# EAGLE design peilsender (EAGLE 5.11)
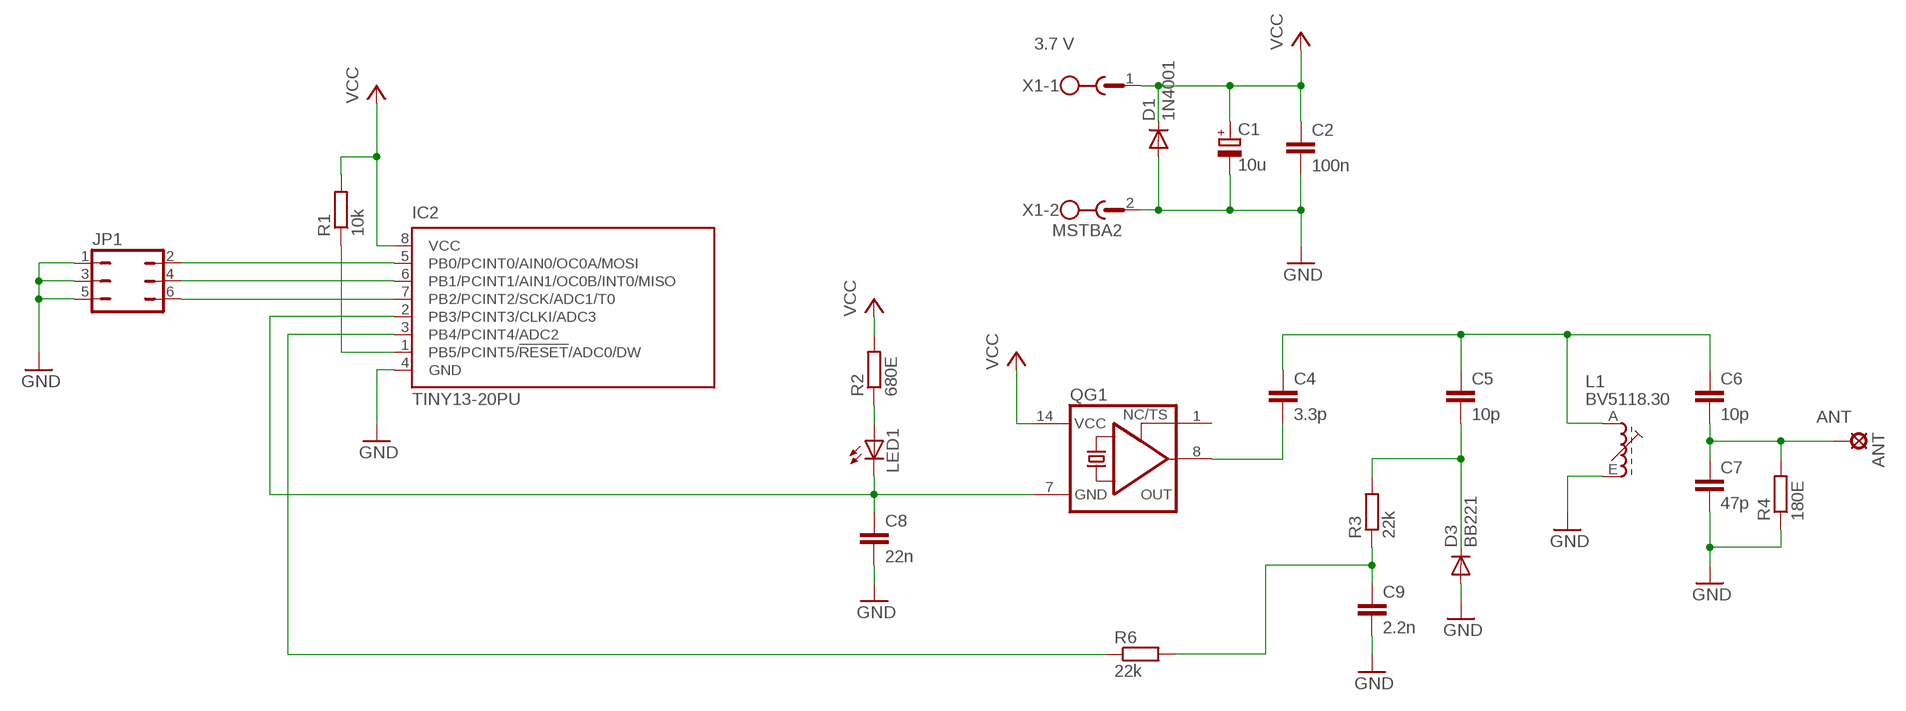
[diagram p0: schematic, sheet 1]

## Parts
ANT  MCS10B  [MCS10B]
C1  10u  CPOL-EUE2.5-5  [E2,5-5]
C2  100n  C-EU025-025X050  [C025-025X050]
C4  3.3p  C-EU025-025X050  [C025-025X050]
C5  10p  C-EU025-025X050  [C025-025X050]
C6  10p  C-EU025-025X050  [C025-025X050]
C7  47p  C-EU025-025X050  [C025-025X050]
C8  22n  C-EU025-025X050  [C025-025X050]
C9  2.2n  C-EU025-025X050  [C025-025X050]
D1  1N4001  DIODE-D-7.5  [D-7.5]
D3  BB221  DIODE-D-7.5  [D-7.5]
IC2  TINY13-20PU  [DIL08]
JP1  JP3Q  [JP3Q]
L1  BV5118.30  71E  [71E]
LED1  LED3MM  [LED3MM]
QG1  XO-14  [DIL14S]
R1  10k  R-EU_0207/12  [0207/12]
R2  680E  R-EU_0207/10  [0207/10]
R3  22k  R-EU_0207/10  [0207/10]
R4  180E  R-EU_0207/10  [0207/10]
R6  22k  R-EU_0207/10  [0207/10]
X1  MSTBA2  [MSTBA2]

## Nets
ANT: ANT.MP C6.2 C7.1 R4.2
GND: C1.- C2.2 C7.2 C8.2 C9.2 D1.A D3.A IC2.4(GND) JP1.1 JP1.3 JP1.5 L1.E R4.1 X1.2
N$1: LED1.A R2.1
N$2: C8.1 IC2.2(PB3/PCINT3/CLKI/ADC3) LED1.K(C) QG1.7(GND)
N$3: C4.2 QG1.8(OUT)
N$4: C4.1 C5.1 C6.1 L1.A
N$5: C5.2 D3.C R3.2
N$6: C9.1 R3.1 R6.2
N$7: IC2.3(PB4/PCINT4/ADC2) R6.1
N$8: IC2.5(PB0/PCINT0/AIN0/OC0A/MOSI) JP1.2
N$9: IC2.6(PB1/PCINT1/AIN1/OC0B/INT0/MISO) JP1.4
N$10: IC2.7(PB2/PCINT2/SCK/ADC1/T0) JP1.6
N$13: IC2.1(PB5/PCINT5/!RESET!/ADC0/DW) R1.1
VCC: C1.+ C2.1 D1.C IC2.8(VCC) QG1.14(VCC) R1.2 R2.2 X1.1
Unconnected: L1.S1 L1.S2 QG1.1(TS)

## Notes on the sheet
- 3.7 V

## Library data of the parts
ANT = solpad:MCS10B: SOLDER PAD MC S1, distributor Buerklin, 15F505
C1 = rcl:CPOL-EU: POLARIZED CAPACITOR, European symbol
C2 C4-C9 = rcl:C-EU: CAPACITOR, European symbol
D1 D3 = diode:DIODE-: DIODE
IC2 = atmel:TINY13: 8-bit AVR Microcontroller with 1K Bytes In-System Programmable Flash Source: http://www.atmel.com/dyn/resources/prod_documents/2535S.pdf; MPN: ATTINY13-20PU; OC_FARNELL: 9171550; OC_NEWARK: 96K6521
JP1 = jumper:JP3Q: JUMPER
L1 = inductor-neosid:71E: FILTER adjustable filter coil, Type E; OC_FARNELL: unknown; OC_NEWARK: unknown
LED1 = led:LED: LED OSRAM: - CHIPLED LG R971, LG N971, LY N971, LG Q971, LY Q971, LO R971, LY R971 LH N974, LH R974 LS Q976, LO Q976, LY Q976 LO Q996 - Hyper CHIPLED LW Q18S LB Q993, LB Q99A, LB R99A - SideLED LS A670, LO A670, LY A670, LG A670, LP A670 LB A673, LV A673, LT A673, LW A673 LH A674 LY A675 LS A676, LA A676, LO A676, LY A676, LW A676 LS A679, LY A679, LG A679 - Hyper Micro SIDELED® LS Y876, LA Y876, LO Y876, LY Y876 LT Y87S - SmartLED LW L88C, LW L88S LB L89C, LB L89S, LG L890 LS L89K, LO L89K, LY L89K LS L896, LA L896, LO L896, LY L896 - TOPLED LS T670, LO T670, LY T670, LG T670, LP T670 LSG T670, LSP T670, LSY T670, LOP T670, LYG T670 LG T671, LOG T671, LSG T671 LB T673, LV T673, LT T673, LW T673 LH T674 LS T676, LA T676, LO T676, LY T676, LB T676, LH T676, LSB T676, LW T676 LB T67C, LV T67C, LT T67C, LS T67K, LO T67K, LY T67K, LW E67C LS E67B, LA E67B, LO E67B, LY E67B, LB E67C, LV E67C, LT E67C LW T67C LS T679, LY T679, LG T679 LS T770, LO T770, LY T770, LG T770, LP T770 LB T773, LV T773, LT T773, LW T773 LH T774 LS E675, LA E675, LY E675, LS T675 LS T776, LA T776, LO T776, LY T776, LB T776 LHGB T686 LT T68C, LB T68C - Hyper Mini TOPLED® LB M676 - Mini TOPLED Santana® LG M470 LS M47K, LO M47K, LY M47K Source: http://www.osram.convergy.de LUXEON: - LUMILED® LXK2-PW12-R00, LXK2-PW12-S00, LXK2-PW14-U00, LXK2-PW14-V00 LXK2-PM12-R00, LXK2-PM12-S00, LXK2-PM14-U00 LXK2-PE12-Q00, LXK2-PE12-R00, LXK2-PE12-S00, LXK2-PE14-T00, LXK2-PE14-U00 LXK2-PB12-K00, LXK2-PB12-L00, LXK2-PB12-M00, LXK2-PB14-N00, LXK2-PB14-P00, LXK2-PB14-Q00 LXK2-PR12-L00, LXK2-PR12-M00, LXK2-PR14-Q00, LXK2-PR14-R00 LXK2-PD12-Q00, LXK2-PD12-R00, LXK2-PD12-S00 LXK2-PH12-R00, LXK2-PH12-S00 LXK2-PL12-P00, LXK2-PL12-Q00, LXK2-PL12-R00 Source: www.luxeon.com KINGBRIGHT: KA-3528ASYC Source: www.kingbright.com
QG1 = crystal:XO-: CRYSTAL; OC_FARNELL: unknown; OC_NEWARK: unknown
R1-R4 R6 = rcl:R-EU_: RESISTOR, European symbol
X1 = con-phoenix-508:MSTBA2: PHOENIX; MF: FARNELL; MPN: 1757242; OC_FARNELL: 3705171; OC_NEWARK: 71C4161

## Board
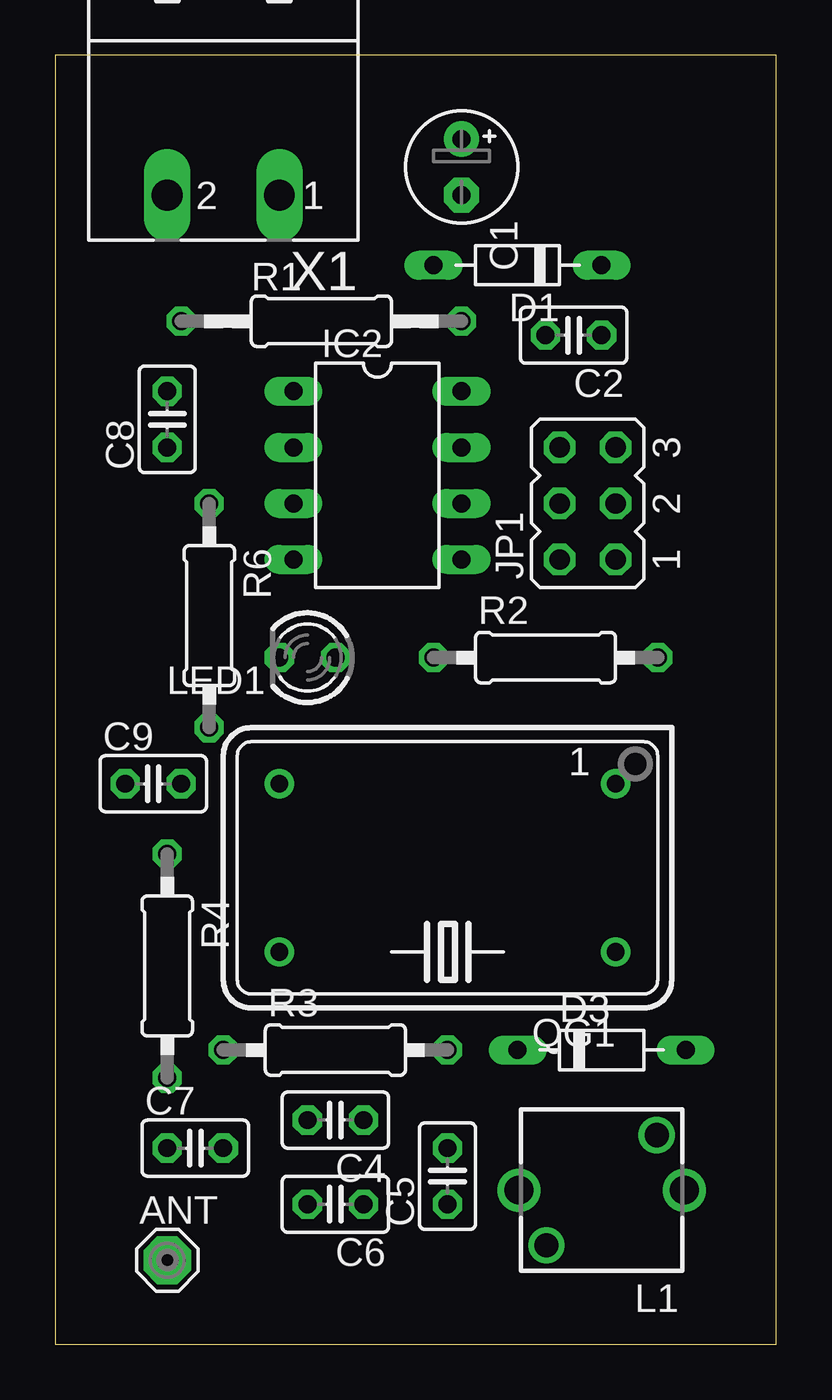
[diagram p1: board, top side]
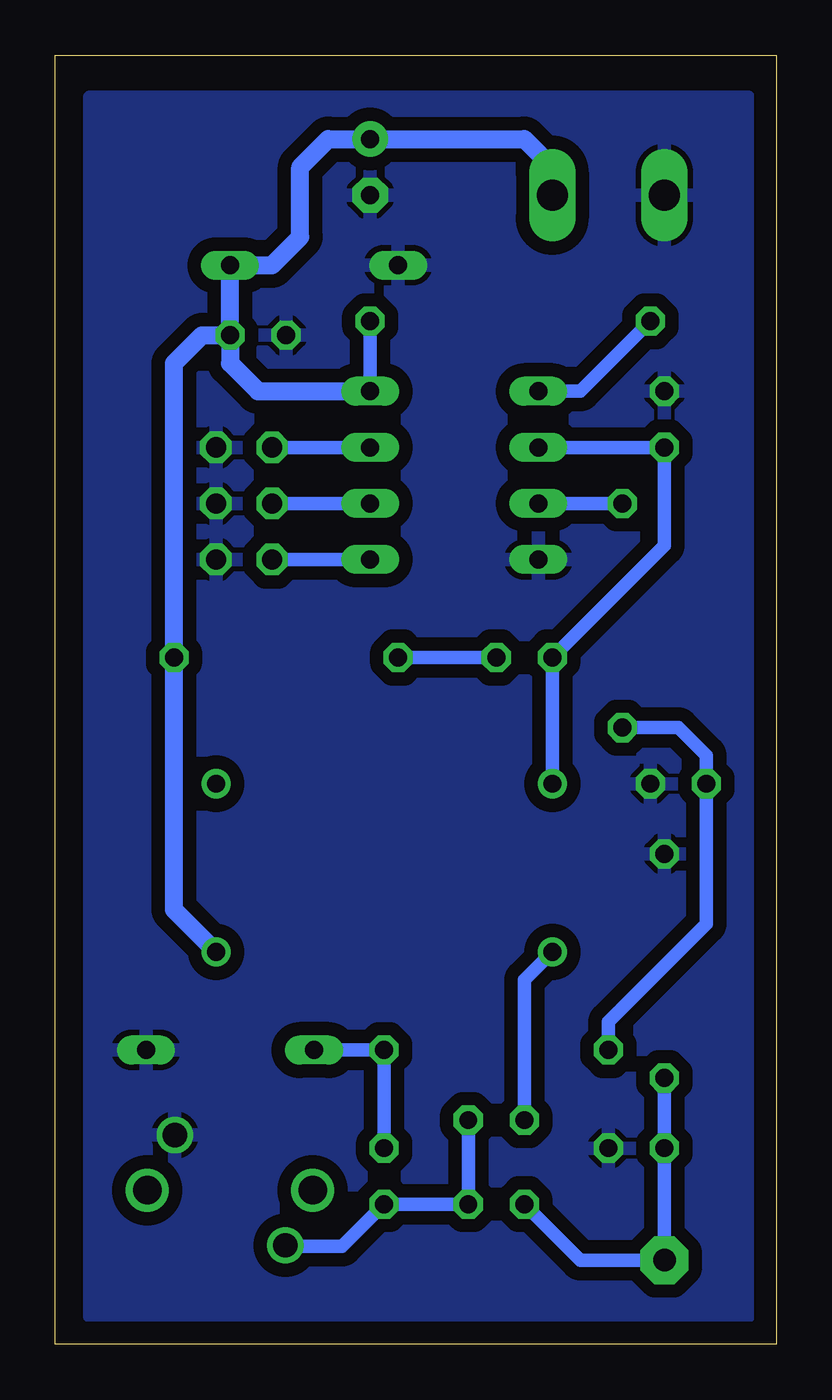
[diagram p2: board, bottom side, seen from below]

Size 32.69 x 58.41 mm. Coordinates in mm from the lower left corner, seen from the top.
Outline: 0,0 32.69,0 32.69,58.41 0,58.41 0,0
Copper layers (1*16): Top 0.035mm / dielectric 1.5mm / Bottom 0.035mm
Design rules "default": minimum track width 10mil, minimum drill 24mil, track to track 8mil, track to pad 8mil, pad to pad 8mil, via to via 8mil, smd to smd 8mil, copper to edge 40mil, drill to drill 8mil, minimum pad ring 10mil, minimum via ring 8mil, stop-mask expansion 4mil, vias tented up to drill 0mil, thermal gap 10mil

### Footprints (pad centres in the part's own frame; a part is rotated, then mirrored left to right if it is on the bottom)
MCS10B = drill 1.016 pad 2.159 octagon: MP 0,0
E2,5-5 = drill 0.813 pad 1.6 round: + -1.27,0 | drill 0.813 pad 1.6 octagon: - 1.27,0
C025-025X050 = drill 0.813 octagon: 1 -1.27,0; 2 1.27,0
D-7.5 = drill 0.813 long: A 3.81,0; C -3.81,0
DIL08 = drill 0.813 long: 1 -3.81,-3.81; 2 -1.27,-3.81; 3 1.27,-3.81; 4 3.81,-3.81; 5 3.81,3.81; 6 1.27,3.81; 7 -1.27,3.81; 8 -3.81,3.81
JP3Q = drill 0.914 octagon: 1 -2.54,-1.27; 2 -2.54,1.27; 3 0,-1.27; 4 0,1.27; 5 2.54,-1.27; 6 2.54,1.27
71E = drill 1.1 round: A 2.5,2.5; E -2.5,-2.5 | drill 1.3 round: S1 -3.75,0; S2 3.75,0
LED3MM = drill 0.813 octagon: A -1.27,0; K 1.27,0
DIL14S = drill 0.813 round: 1 -7.62,-3.81; 7 7.62,-3.81; 8 7.62,3.81; 14 -7.62,3.81
0207/12 = drill 0.813 octagon: 1 -6.35,0; 2 6.35,0
0207/10 = drill 0.813 octagon: 1 -5.08,0; 2 5.08,0
MSTBA2 = drill 1.397 long: 1 -2.54,5.08; 2 2.54,5.08

### Placement (x,y rotation side)
ANT  5.08,3.81 0 top
C1  18.41,53.34 270 top
C2  23.5,45.72 180 top
C4  12.7,10.16 180 top
C5  17.78,7.62 90 top
C6  12.7,6.35 180 top
C7  6.35,8.89 0 top
C8  5.08,41.91 90 top
C9  4.45,25.4 0 top
D1  20.95,48.9 180 top
D3  24.77,13.34 0 top
IC2  14.61,39.37 270 top
JP1  24.13,38.1 90 top
L1  24.77,6.99 180 top
LED1  11.43,31.11 180 top
QG1  17.78,21.59 180 top
R1  12.06,46.35 0 top
R2  22.23,31.11 0 top
R3  12.7,13.34 0 top
R4  5.08,17.14 270 top
R6  6.99,33.02 270 top
X1  7.62,57.15 180 top

### Tracks (layer width: path | path; a pad name or v marks a point on that pad's centre or on a via)
ANT
  Bottom 0.61: C6.2 8.89,3.81 ANT.MP C7.1 R4.2
GND
  pour Bottom (isolate 0.61): 1.27,56.52 31.11,56.52 31.11,1.27 1.27,1.27
N$1
  Bottom 0.61: LED1.A R2.1
N$2
  Bottom 0.61: IC2.2 C8.1 5.08,36.2 LED1.K QG1.7
N$3
  Bottom 0.61: C4.2 11.43,16.51 QG1.8
N$4
  Bottom 0.61: C4.1 C6.1 C5.1 19.68,4.45 22.23,4.45 L1.A
N$5
  Bottom 0.61: C5.2 R3.2 D3.C
N$6
  Bottom 0.61: R6.2 4.45,27.94 3.17,26.67 C9.1 3.17,19.05 7.62,14.61 R3.1
N$7
  Bottom 0.61: R6.1 IC2.3
N$8
  Bottom 0.61: IC2.5 JP1.2
N$9
  Bottom 0.61: IC2.6 JP1.4
N$10
  Bottom 0.61: IC2.7 JP1.6
N$13
  Bottom 0.61: IC2.1 8.89,43.18 R1.1
VCC
  Bottom 0.61: IC2.8 R1.2
  Bottom 0.813: QG1.14 27.3,19.68 R2.2 27.3,44.45 26.04,45.72 C2.1 | X1.1 10.16,53.34 11.43,54.61 C1.+ 20.32,54.61 21.59,53.34 21.59,50.16 22.86,48.9 D1.C C2.1 | IC2.8 23.5,43.18 24.77,44.45 C2.1